# Altium schematic sheet Type-It.SchDoc
size A
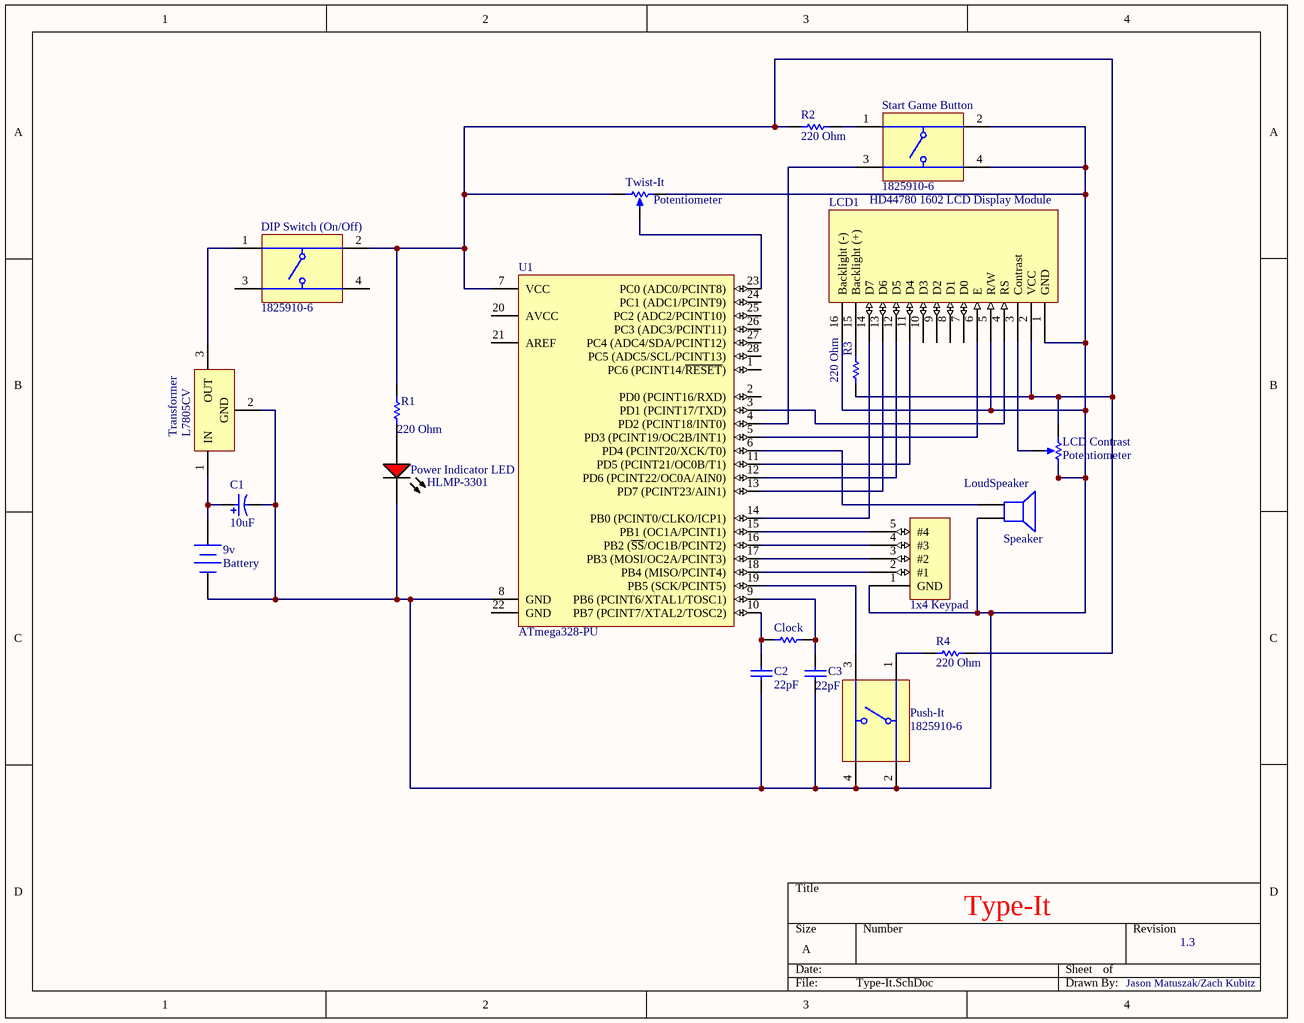
[diagram p0: Type-It.SchDoc]

## Parts
9v  Battery  [BAT-2]
?  1x4 Keypad
C1  10uF  [CAPPR55-200-1100X500X1200]
C2  22pF  [KEMT-C315-THT-2]
C3  22pF  [KEMT-C315-THT-2]
Clock  (no value)  [RESA60-630X240]
DIP_Switch_(On/Off)  1825910-6  [TECO-1825910-6_V]
LCD1  HD44780 1602 LCD Display Module
LCD_Contrast  Potentiometer  [BOUR-3852A-282-103AL-3_V]
LoudSpeaker  Speaker  [PIN2]
Power_Indicator_LED  HLMP-3301  [AVAG-HLMP-3301-2]
Push-It  1825910-6  [TECO-1825910-6_V]
R1  220 Ohm  [RESA60-630X240]
R2  220 Ohm  [RESA60-630X240]
R3  220 Ohm  [RESA60-630X240]
R4  220 Ohm  [RESA60-630X240]
Start_Game_Button  1825910-6  [TECO-1825910-6_V]
Transformer  L7805CV  [TO220]
Twist-It  Potentiometer  [BOUR-3852A-282-103AL-3_V]
U1  ATmega328-PU  [28P3]

## Nets
Net9v_1: 9v.1(+) C1.1 Transformer.1(IN)
Net9v_2: 9v.2(-) ?.1(GND) C1.2 C2.1 C3.1 LCD1.1(GND) LCD1.5(R/W) LCD1.16(Backlight_(-)) LCD_Contrast.3(CW) LoudSpeaker.2 Power_Indicator_LED.1(K) Push-It.2 Push-It.4 Start_Game_Button.2 Start_Game_Button.4 Transformer.2(GND) Twist-It.3(CW) U1.8(GND)
Net?_2: ?.2(#1) U1.18(PB4_(MISO/PCINT4))
Net?_3: ?.3(#2) U1.17(PB3_(MOSI/OC2A/PCINT3))
Net?_4: ?.4(#3) U1.16(PB2_(~{SS}/OC1B/PCINT2))
Net?_5: ?.5(#4) U1.15(PB1_(OC1A/PCINT1))
NetC2_2: C2.2 Clock.2 U1.10(PB7_(PCINT7/XTAL2/TOSC2))
NetC3_2: C3.2 Clock.1 U1.9(PB6_(PCINT6/XTAL1/TOSC1))
NetDIP_Switch_(On/Off)_1: DIP_Switch_(On/Off).1 Transformer.3(OUT)
NetDIP_Switch_(On/Off)_2: DIP_Switch_(On/Off).2 LCD1.2(VCC) LCD_Contrast.1(CCW) R1.2 R2.2 R3.1 R4.1 Twist-It.1(CCW) U1.7(VCC)
NetLCD1_3: LCD1.3(Contrast) LCD_Contrast.2(S)
NetLCD1_4: LCD1.4(RS) U1.3(PD1_(PCINT17/TXD))
NetLCD1_6: LCD1.6(E) U1.5(PD3_(PCINT19/OC2B/INT1))
NetLCD1_11: LCD1.11(D4) U1.11(PD5_(PCINT21/OC0B/T1))
NetLCD1_12: LCD1.12(D5) U1.12(PD6_(PCINT22/OC0A/AIN0))
NetLCD1_13: LCD1.13(D6) U1.13(PD7_(PCINT23/AIN1))
NetLCD1_14: LCD1.14(D7) U1.14(PB0_(PCINT0/CLKO/ICP1))
NetLCD1_15: LCD1.15(Backlight_(+)) R3.2
NetLoudSpeaker_1: LoudSpeaker.1 U1.6(PD4_(PCINT20/XCK/T0))
NetPower_Indicator_LED_2: Power_Indicator_LED.2(A) R1.1
NetPush-It_1: Push-It.1 R4.2
NetPush-It_3: Push-It.3 U1.19(PB5_(SCK/PCINT5))
NetR2_1: R2.1 Start_Game_Button.1
NetStart_Game_Button_3: Start_Game_Button.3 U1.4(PD2_(PCINT18/INT0))
NetTwist-It_2: Twist-It.2(S) U1.23(PC0_(ADC0/PCINT8))

Not connected (* = marked no-connect by the designer): DIP_Switch_(On/Off) 3 4; LCD1 7(D0) 8(D1) 9(D2) 10(D3); U1 1(PC6_(PCINT14/~{RESET})) 2(PD0_(PCINT16/RXD)) 20(AVCC) 21(AREF) 22(GND) 24(PC1_(ADC1/PCINT9)) 25(PC2_(ADC2/PCINT10)) 26(PC3_(ADC3/PCINT11)) 27(PC4_(ADC4/SDA/PCINT12)) 28(PC5_(ADC5/SCL/PCINT13))

## Notes on the sheet
- Type-It
- 1.3
- Jason Matuszak/Zach Kubitz

## Library data of the parts
9v = Battery: Multicell Battery; Published: 24-Mar-1999; LatestRevisionDate: 17-Jul-2002; LatestRevisionNote: Re-released for DXP Platform.; PackageReference: BAT-2; Publisher: Altium Limited; PackageDescription: Battery; 2 Leads
C1 = CMP-2100-03622-1: Aluminum Electrolytic Capacitor, 10 uF, +/- 20%, 50 V, -40 to 85 degC, 2-Pin THD, RoHS, Bulk; Manufacturer: Panasonic; Life (Hours): 2000Hour; Lead/Base Style: Straight; Dissipation Factor: 0.12%; Leakage Current: 3uA; Dielectric Material: Aluminium; Lead Diameter: 0.5mm; Voltage Rating: 50V; Ripple Current: 65mA; Package Reference: CAPPR55-200-1100X500X1200; Height: 11mm; Diameter: 5mm; REACH SVHC: NoSVHC; Mount: ThroughHole; Packaging: Bulk; Manufacturer URL: http://www.panasonic.com/; Capacitance: 10uF; Termination: Radial; Datasheet URL: https://industrial.panasonic.com/cdbs/www-data/pdf/RDF0000/ABA0000C1218.pdf; Lead Free: LeadFree; Height - Seated (Max): 0.472inch; Case/Package: Radial; Package Description: 2-Pin Radial Lead, Dia 5 mm, Height 12 mm; Tolerance: 20%; Datasheet Version: Rev. 05, 10/2016; Package Quantity: 200; Ripple Current (AC): 65mA; Min Operating Temperature: -40degC; RoHSCompliant: true; Number of Pins: 2; Max Operating Temperature: 85degC; Voltage: 50V; Lead Pitch: 2mm; Radiation Hardening: No; Voltage Rating (DC): 50V; Length: 11mm
C2 C3 = CMP-1664-00008-1: Capacitor, Ceramic, 22 pF, +/-10 %, 100 V, -55 to 125 degC, 2-Pin THD, RoHS, Bulk; Max Input Voltage: 40 V; Min Input Voltage: 4.2 V; Output Current: 1.5 A; Output Voltage: 1.2 V; Outputs: 1; Case\Package: TO-220; RoHSCompliant: true; Min Operating Temperature: 0 degC; Max Operating Temperature: 125 degC; Package Quantity: 50; ComponentLink2URL: http://capacitoredge.kemet.com/capedge2/DataSheet/Datasheet-C315C220K1G5TA.pdf?pn=C315C220K1G5TA{BULK}; Radiation Hardening: No; Pins: 3; Length: 10.28 mm; ComponentLink1URL: http://www.kemet.com/; ComponentLink2Description: Datasheet; Height: 9.28 mm; REACH SVHC: No SVHC; ComponentLink1Description: Manufacturer URL; Max Ouput Current: 1.5 A; Weight: 0.08113 oz; Packaging: Rail/Tube; DatasheetVersion: Aug-16; Mount: Through Hole; PackageReference: C315-THT-2; Width: 4.82 mm; PackageDescription: 2-Pin Through Hole Device, Body 3.81 x 2.54 mm
Clock R1-R4 = CMP-1659-00063-1: Axial Resistor, 47.5 KOhm, +/- 1%, 0.25 W, -55 to 155 degC, 2-Pin THD, RoHS, Bulk; Tolerance: 20%; Shielding: Shielded; Current Rating: 1.3 A; Case\Package: 1008; ComponentLink1Description: Manufacturer URL; Packaging: Tape and Reel; ComponentLink2Description: Datasheet; Radiation Hardening: No; ComponentLink2URL: http://www.yageo.com/documents/recent/Yageo%20LR_MFR_2013.pdf; Min Operating Temperature: -55 degC; Mount: Surface Mount; Width: 2 mm; Length: 2.5 mm; Max Operating Temperature: 125 degC; PackageReference: MFR-25; Height: 1.2 mm; ComponentLink1URL: http://www.yageo.com/; DatasheetVersion: Apr-13; RoHSCompliant: true; Package Quantity: 3000; Case Code (Metric): 2520; PackageDescription: 2-Pin Axial Lead, Dia 2.4 mm, Body Length 6.3 mm
DIP_Switch_(On/Off) Push-It Start_Game_Button = CMP-1684-00021-1: Tact Switch, SPST-NO, 0.05 A, -35 to 85 degC, 4-Pin THD, RoHS, Bulk; Manufacturer: TE Connectivity; Maximum Contact Resistance: 100mOhm; Mechanical Life: 100000Cycles; Bushing Type: Unthreaded; Switch Configuration: OFF(ON); Maximum DC Voltage Rating: 24V; Contact Rating @ Voltage: 0.05A@24VDC; Actuator Color: Black; Body Orientation: Straight; Function: MomentaryContact; Illumination: N/R; Actuator Style: RoundButton; Actuator Material: PolybutyleneTerephthalate; Dielectric Strength: 500VAC; Pole Throw Configuration: SPST; Actuator Length: 1.4mm; Product Weight: N/A; Contact Material: CopperAlloy; Housing Material: N/A; Terminal Type: PCPins; Minimum Insulation Resistance: 100MOhm; Package Description: 4-Pin Through Hole Device, Body 5.99 x 5.99 mm, Pitch 6.5 mm; Part No: 1825910-6; Package Reference: THD; Base Material: N/A; Manufacturer URL: http://www.te.com; Contact Plating: Silver; RoHS: Yes; Datasheet Version: Rev. C9; Electrical Life: 100000Cycles; Maximum AC Voltage Rating: N/A; Thread Size: N/R; Operating Temperature: -35to85C; Mounting: ThroughHole; Dimension: 5.99x5mm; Datasheet URL: http://www.te.com/commerce/DocumentDelivery/DDEController?Action=showdoc&DocId=Customer+Drawing%7F1825910%7FC9%7Fpdf%7FEnglish%7FENG_CD_1825910_C9.pdf%7F1825910-6; Family: 1825910; Seal Location: N/A; Seal Description: N/A; Packaging: N/A
LCD1 = 16x2 LCD Display: 1602 standard 16-pin interface, including: / Pin 1: VSS is the ground power. / 2 feet: VDD then 5V positive power supply. / 3 feet: V0 LCD contrast adjustment end, then the positive power supply when the contrast is the weakest, the highest contrast when grounded power, the contrast is too high will have a "ghosting", when used by a 10K potentiometer to adjust the contrast. / 4 feet: RS for the register selection, high-level data register selection, low-level instruction register selection. / 5 feet: R / W for the read and write signal lines, high-level read operation, low-level write operation. / 6th foot: E end is enable end, when E end jumps from high level to low level, the liquid crystal module carries out the order. / 7 ~ 14 feet: D0 ~ D7 for the 8-bit bidirectional data lines. / 15 feet: the positive power supply backlight / 16th foot: backlight power negative
LCD_Contrast Twist-It = CMP-2000-05079-1: Diameter Panel Control, 10 KOhm, +/- 10%, 2 W, -1 to 125 degC, 3-Pin THD, RoHS, Bulk; Manufacturer: Bourns; Temperature Coefficient: ±150ppm/degC; Number of Gangs: 1; Other Names: 3852A282103AL; Actuator Length: 0.875"(22.23mm); Resistive Material: Cermet; PCN Design/Specification: PBTResinJun/2011; Rotation: 280deg; PCN Other: MultipleChanges01/Dec/2012; Catalog Drawings: 3852SeriesSide1 / 3852SeriesSide2; Online Catalog: 3852and3856Series; Associated Product: 36-8560-ND / -KNOBINSTRUMW/DIALRND.9"DIA / 36-8555-ND / -KNOBINSTRUMSKIRTEDRND.7"DIA / 36-8556-ND / -KNOBINSTRUMSKIRTEDRND.9"DIA / 36-8565-ND / -KNOBINSTRUMDBLBARRND.7"DIA / 36-8566-ND / -KNOBINSTRUMDBLBARRND.9"DIA / 36-8568-ND / -KNOBINSTRUMSGLBARRND.7"DIA / 36-8569-ND / -KNOBINSTRUMSGLBARRND.9"DIA / 36-8559-ND / -KNOBINSTRUMW/DIALRND.7"DIA / 226-1006-ND / -KNOBBLKGLOSS.75"DIA.250"SHAFT / 226-1007-ND / -KNOBBLKGLOSS.925"DIA.250"SHAFT / 226-1011-ND / -KNOBBLKGLOS; Actuator Diameter: 0.250"(6.35mm); Built in Switch: None; Resistance (Ohms): 10k; Power (Watts): 2W; Actuator Type: Slotted; Standard Package: 45; Tolerance: ±10%; Taper: Linear; Series: 3852; Packaging: Bulk; Category: Potentiometers,VariableResistors; Bushing Thread: 3/8-32; Datasheet URL: https://datasheet.ciiva.com/11831/0900766b80f93b4b-11831016.pdf; Datasheet Version: Sep-14; Number of Turns: 1; Family: RotaryPotentiometers,Rheostats; Termination Style: SolderLug; RoHS Information: 3852A-LMaterialDeclaration; Mounting Type: PanelMount; Manufacturer URL: http://www.bourns.com/
LoudSpeaker = Speaker: Loudspeaker; Published: 24-Mar-1999; LatestRevisionDate: 17-Jul-2002; LatestRevisionNote: Re-released for DXP Platform.; PackageReference: PIN2; Publisher: Altium Limited
Power_Indicator_LED = CMP-2000-06411-1: T-1 3/4 (5 mm) Diffused LED Lamp, 1.9 V, -40 to 100 degC, 2-Pin THD, RoHS, Bulk; Manufacturer: Avago; Forward Current: 25mA; Forward Voltage: 2.4V; Peak Wavelength: 635nm; Shape Type: Circular; High Brightness: No; Main Category: StandardLED; Test Current (It): 10mA; Dominant Wave Length: 626nm; Number of  Elements: 1; Reverse Voltage: 5V; Chip Material: GaP; Product Height (mm): 9.19mm; Lens Type: ColoredDiffused; Viewing Angle: 60deg; Emitting Color: Red; Luminous Intensity: 5.4mcd; Power Dissipation: 85W; DELETED: Compliant; Product Depth (mm): 6.1mm; Package Description: 2-Pin Through Hole LED, Dia 5.85 mm; Mounting Technology: ThroughHole; Manufacturer URL: http://www.avagotech.com/; Package Type: T-13/4; Operating Temp Range: -40Cto100C; Datasheet URL: http://www.avagotech.com/docs/AV02-1558EN; Mounting: ThroughHole; Lens Dimensions: 5.08x5.08x8.3mm; Package Reference: HLMP-3301; Datasheet Version: 03/2015; Pin Count: 2; Packaging: TapeandReel; Type: Uni-Color; Operating Temperature Classification: Industrial; Lum Intensity: 5.4mcd; Rad Hardened: No; Product Length (mm): 6.1mm
Transformer = CMP-0244-00483-1: Positive Voltage Regulator, 5V, 3-Pin TO-220; PackageDescription: TO, Thru-Hole, Vertical, Heatsink Mounted; 3 In-Line Leads; Pitch 2.54 mm; ComponentLink2Description: Datasheet; PackageReference: TO220; ComponentLink3URL: http://www.st.com/internet/com/TECHNICAL_RESOURCES/TECHNICAL_LITERATURE/PACKAGE_INFORMATION/CD00004649.pdf; DatasheetVersion: 16/11/2011; ComponentLink1Description: Manufacturer URL; ComponentLink1URL: http://www.st.com; PackageVersion: ver3.0; ComponentLink3Description: Package Specification; ComponentLink2URL: http://www.st.com/internet/com/TECHNICAL_RESOURCES/TECHNICAL_LITERATURE/DATASHEET/CD00000444.pdf
U1 = CMP-0095-00015-2: 8-bit AVR Microcontroller, 32KB Flash, 1KB EEPROM, 2KB SRAM, 28-pin PDIP, Industrial Grade (-40°C to 85°C); ComponentLink3Description: ATmega48A/48PA/88A/88PA/168A/168PA/328/328P Summary; RevisionNote: DatasheetVersion updated. URLs added.; DatasheetVersion: revD, May-2011; ComponentLink1URL: http://www.atmel.com/; PackageVersion: revB, Sep-2001; PackageDescription: 28-lead (0.300"/7.62mm Wide) Plastic Dual Inline Package (PDIP); PackageReference: 28P3; ComponentLink1Description: Manufacturer URL; ComponentLink2Description: ATmega48A/48PA/88A/88PA/168A/168PA/328/328P Datasheet; ComponentLink3URL: http://www.atmel.com/dyn/resources/prod_documents/8271S.pdf; ComponentLink2URL: http://www.atmel.com/dyn/resources/prod_documents/8271.pdf